# EasyEDA schematic ISL.json

## Sheets
1 Sheet_1: TITLE: Sheet_1; REV: 1.0; Date: 2025-07-10; Sheet: 1/1; Company: Your Company
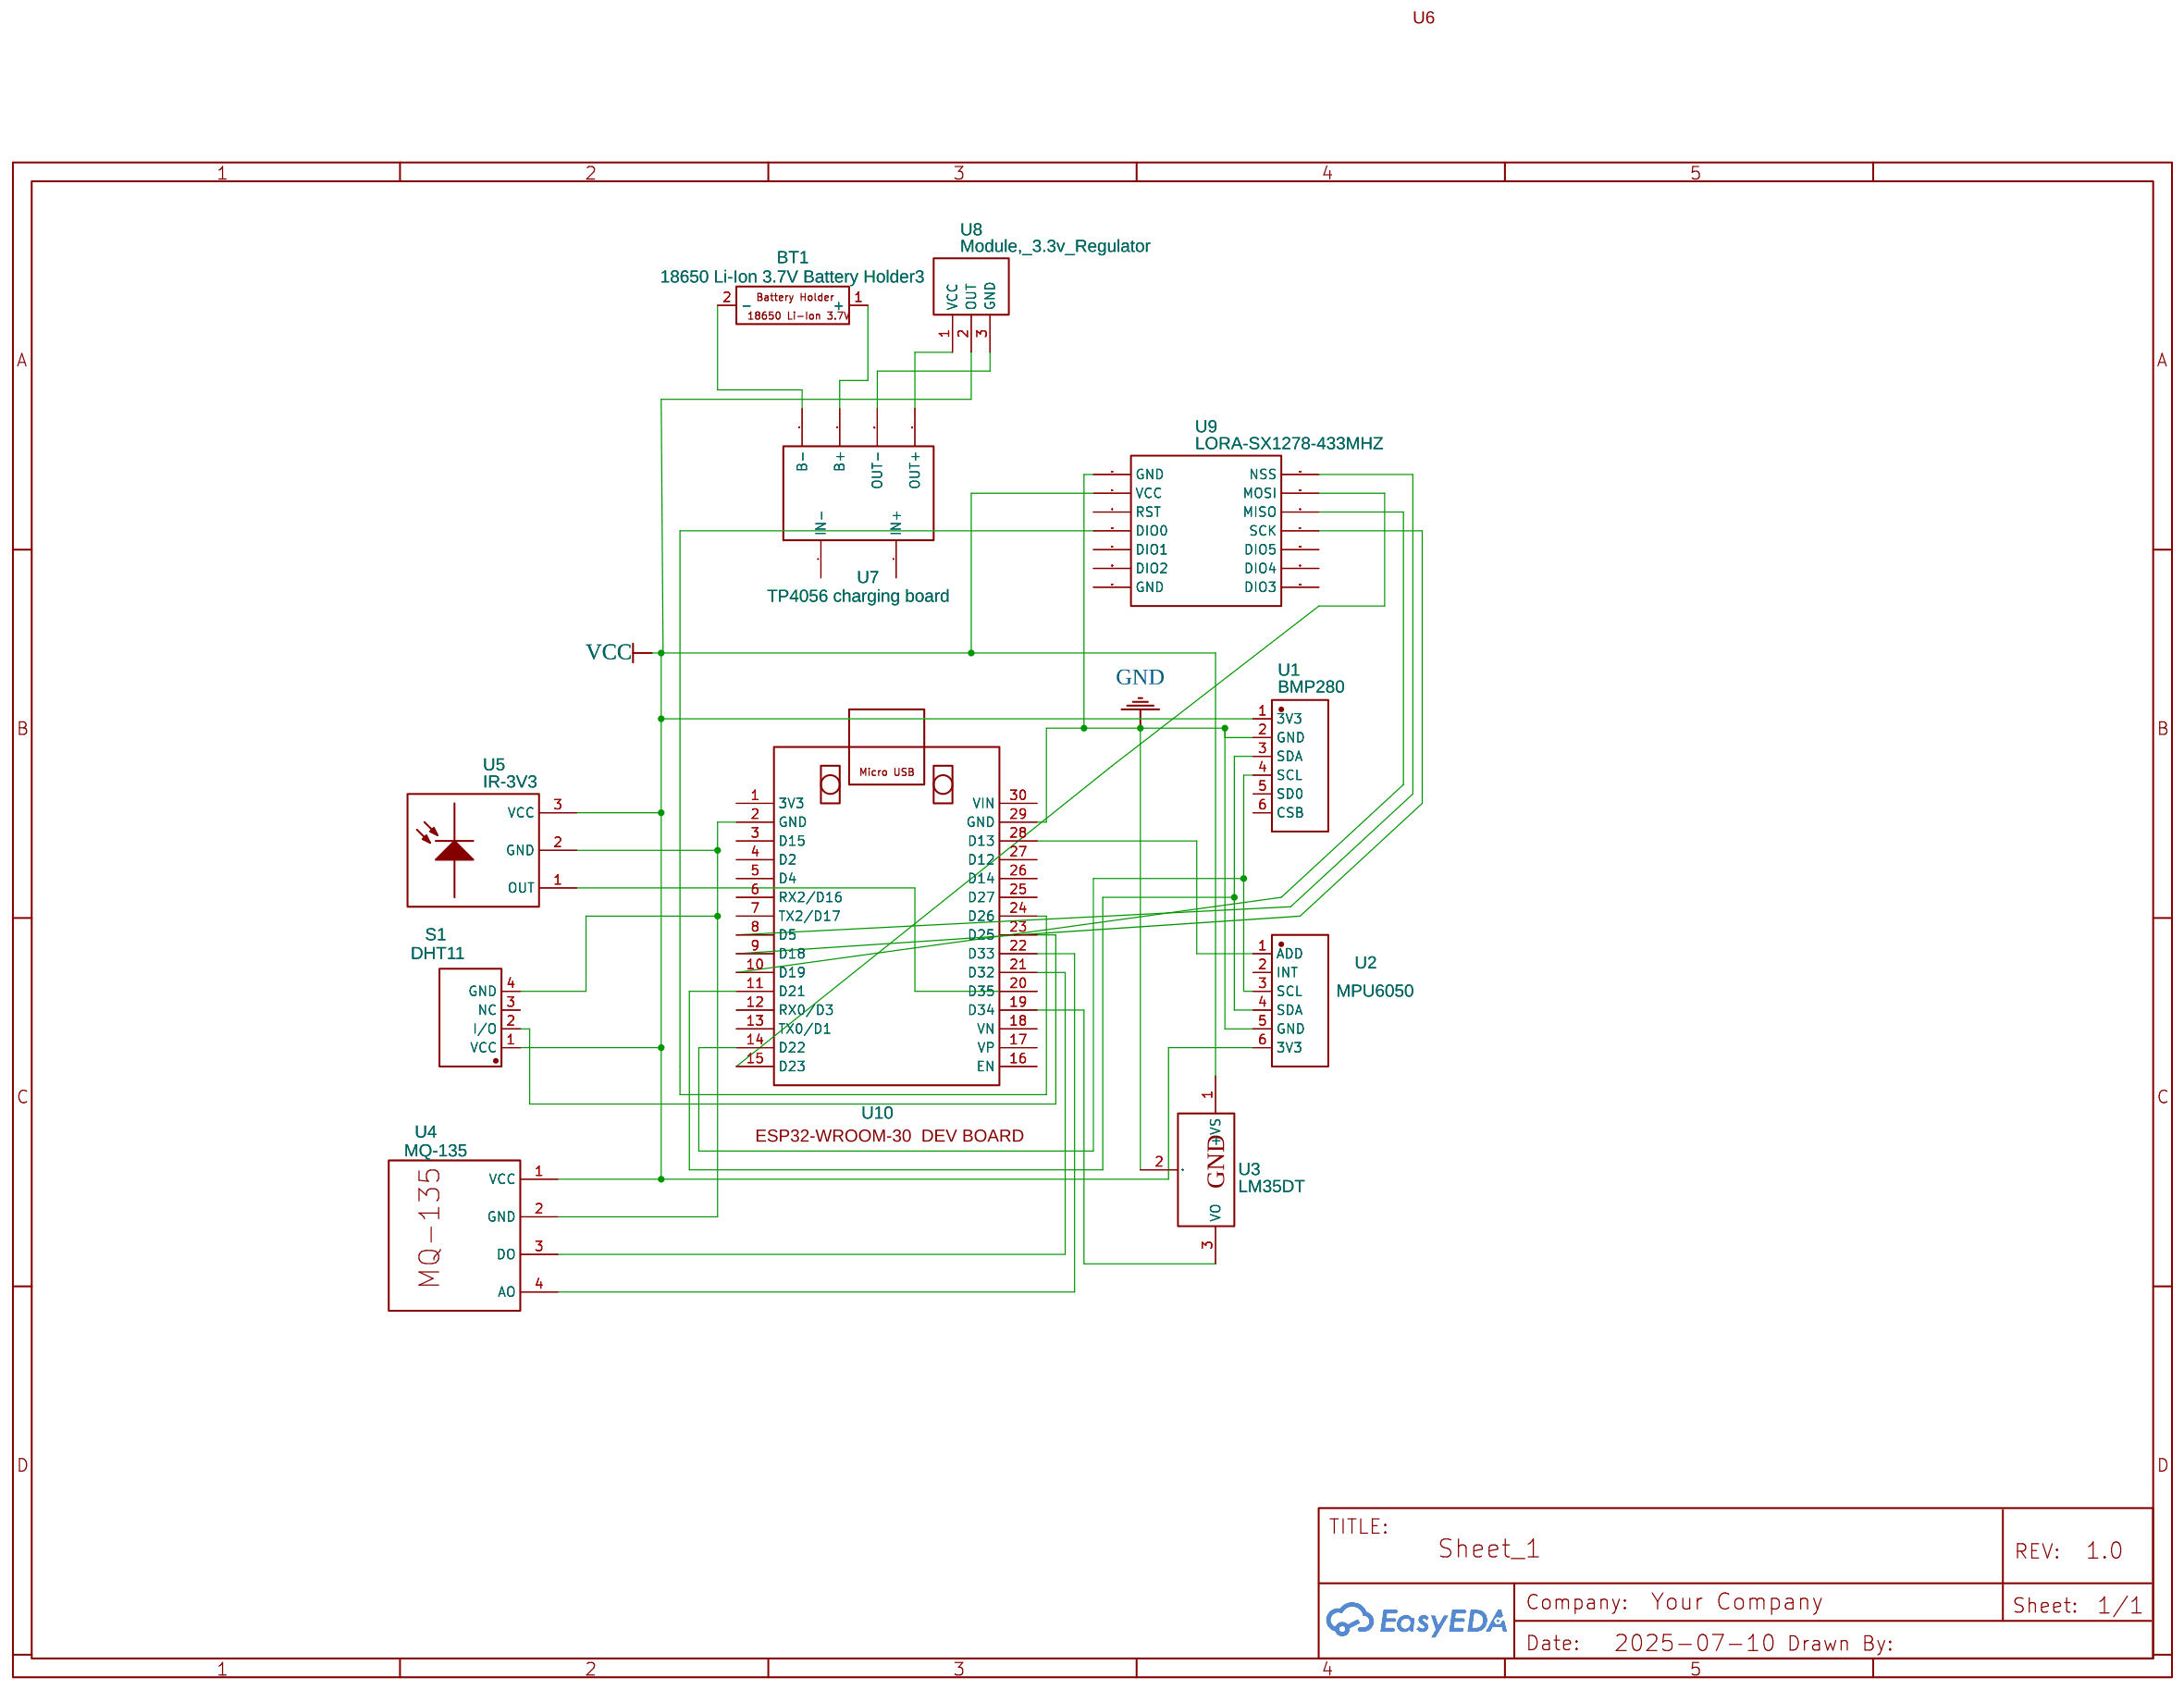
[diagram p0: Sheet_1]
2 Sheet_2: TITLE: Sheet_2; Date: 2025-07-12
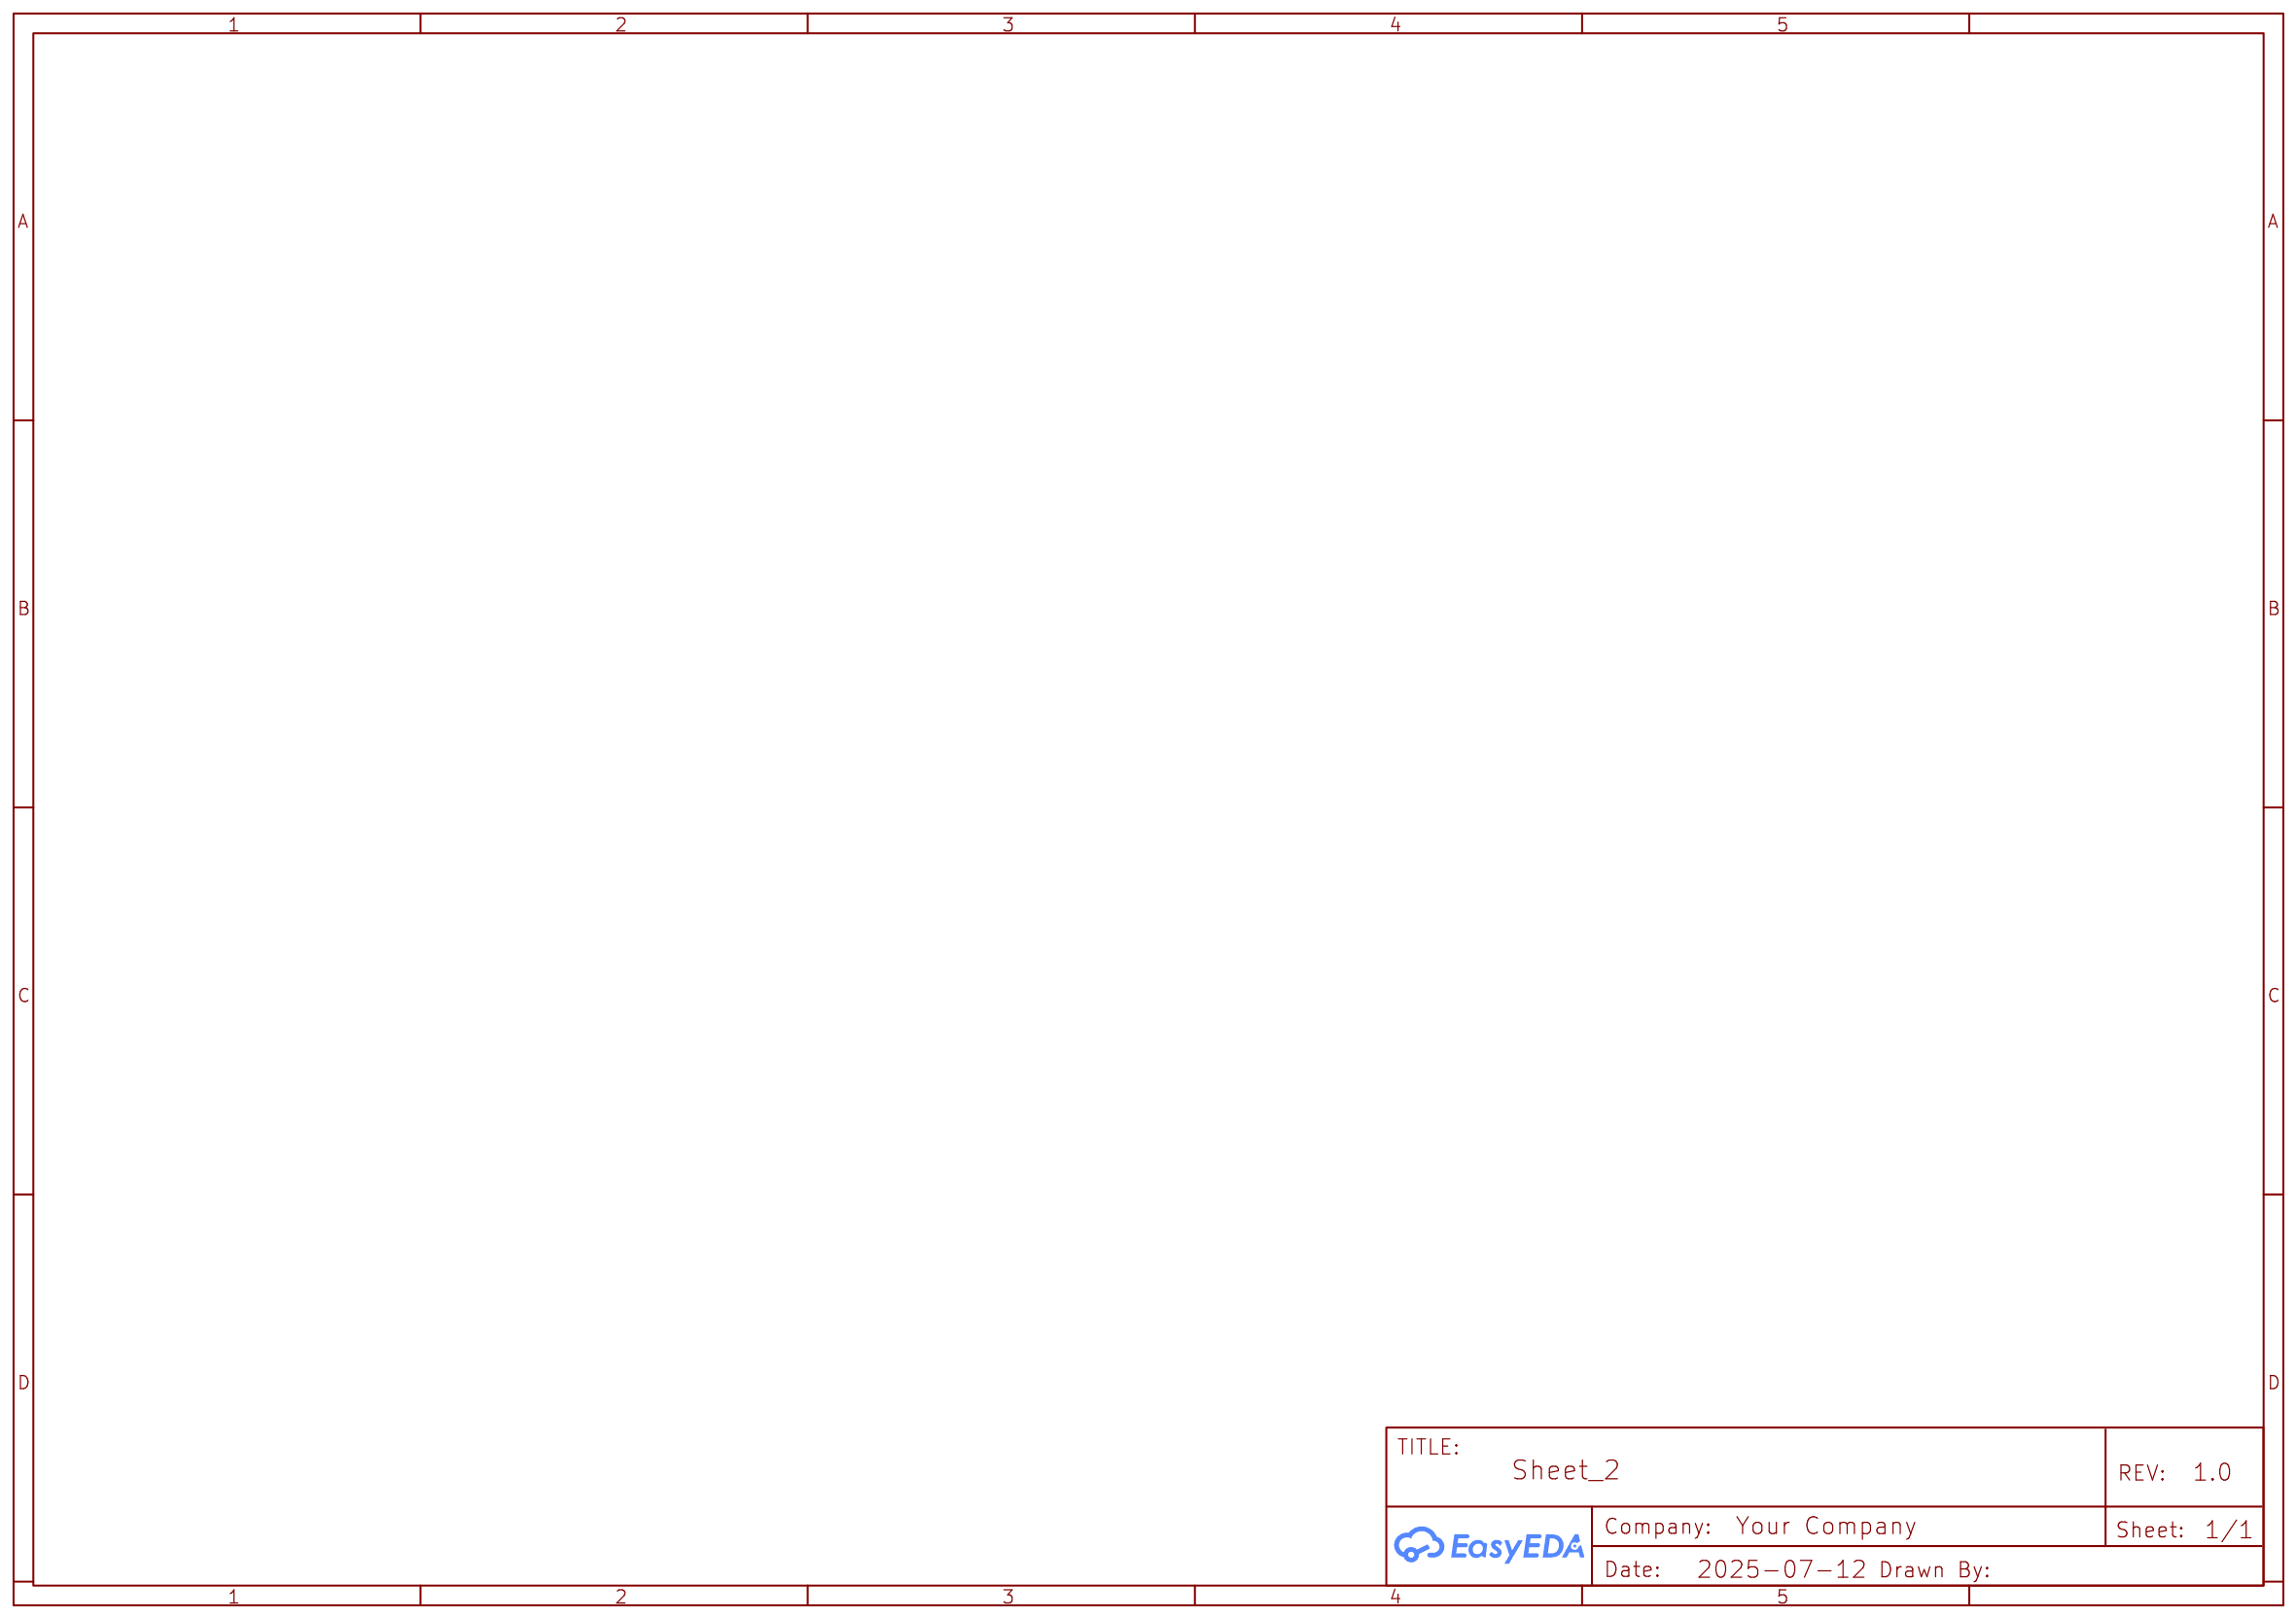
[diagram p1: Sheet_2]

## Parts
BT1  18650 Li-Ion 3.7V Battery Holder3  [18650 LI-ION 3.7V BATTERY HOLDER]
S1  DHT11  [SENSOR-TH_DHT11-1]
U1  BMP280  [COMM-TH_BMP280-TH]
U2  MPU6050  [COMM-TH_MPU6050-TH]
U3  LM35DT  [TO-220-3_L10.0-W4.5-P2.54-L]
U4  MQ-135  [MQ-135]
U5  IR-3V3  [OPTO-TH_3P_L5.3-W4.3]
U7  TP4056 charging board  [TP4056 CHARGING BOARD]
U8  Module,_3.3v_Regulator  [5V_TO_3.3V_STEP-DOWN_VOLTAGE_REGULATOR_AMS1117]
U9  LORA-SX1278-433MHZ  [LORA-SX1278-433MHZ]
U10  ESP32-WROOM-30  DEVB  [ESP32-WROOM-30-DEVBOARD]

## Library data of the parts
BT1 = 18650 Li-Ion 3.7V Battery Holder3: Manufacturer: Smartcube; Manufacturer Part: 18650_Li_BT_3P7V; Supplier Part: 18650_Li_BT_3P7V; Contributor: darrell.devanaputra
S1 = DHT11_C87032: Supplier Part: C87032; Supplier: LCSC; Manufacturer: AOSONG; JLCPCB Part Class: Extended Part
U1 = BMP280_C9900132626: Supplier: LCSC; Supplier Part: C9900132626; Manufacturer: null; Contributor: lcsc
U2 = MPU6050-TH: Supplier: LCSC; Supplier Part: C9900132629; Manufacturer: null; Contributor: lcsc
U3 = LM35DT: Supplier: LCSC; Manufacturer: TI(德州仪器); Manufacturer Part: LM35DT/NOPB; Supplier Part: C32861; JLCPCB Part Class: Extended Part
U4 = MQ-135 SENSOR COPY: Contributor: nikolay.mediana
U5 = IR-3V3: Contributor: lcsc; Supplier: LCSC; Supplier Part: C9900012789; Manufacturer: null; JLCPCB Part Class: Extended Part
U7 = TP4056 charging board: Contributor: gameboycamera
U8 = Module,_3.3v_Regulator: Manufacturer Part: Module, 3.3v Regulator; Contributor: b_amnart
U9 = LORA-SX1278-433MHZ: Manufacturer Part: New SchematicLib; Contributor: jpuelpan528; link: https://www.aliexpress.com/item/SX1276-SX3km-1278-433MHz-Wireless-Transceiver-Module-Long-Distance-Receiver-and-transmitter-LoRa-SPSP-Module/32711941138.html?spm=2114.13010708.0.0.3a994c4d5e4gik
U10 = ESP32-WROOM-30  DEVB: Contributor: elias.beche

## Nets
GND: U1.2(GND) U2.5(GND) U3.2(GND) U9.GND U10.29(GND)
VCC: S1.1(VCC) U1.1(3V3) U2.6(3V3) U3.1(+VS) U4.1(VCC) U5.3(VCC) U8.2(OUT) U9.VCC
Net-(BT1-1): BT1.1(+) U7.B+
Net-(BT1-2): BT1.2(-) U7.B-
Net-(S1-2): S1.2(I/O) U10.23(D25)
Net-(S1-4): S1.4(GND) U4.2(GND) U5.2(GND) U10.2(GND)
Net-(U1-3): U1.3(SDA) U2.4(SDA) U10.11(D21)
Net-(U1-4): U1.4(SCL) U2.3(SCL) U10.14(D22)
Net-(U2-1): U2.1(ADD) U10.28(D13)
Net-(U3-3): U3.3(VO) U10.19(D34)
Net-(U4-3): U4.3(DO) U10.21(D32)
Net-(U4-4): U4.4(AO) U10.22(D33)
Net-(U5-1): U5.1(OUT) U10.20(D35)
Net-(U7-OUT+): U7.OUT+ U8.1(VCC)
Net-(U7-OUT-): U7.OUT- U8.3(GND)
Net-(U9-DIO0): U9.DIO0 U10.24(D26)
Net-(U9-MISO): U9.MISO U10.10(D19)
Net-(U9-MOSI): U9.MOSI U10.15(D23)
Net-(U9-NSS): U9.NSS U10.8(D5)
Net-(U9-SCK): U9.SCK U10.9(D18)

Not connected (* = marked no-connect by the designer): S1 3(NC); U1 5(SD0) 6(CSB); U2 2(INT); U7 IN+ IN-; U9 DIO1 DIO2 DIO3 DIO4 DIO5 RST; U10 1(3V3) 3(D15) 4(D2) 5(D4) 6(RX2/D16) 7(TX2/D17) 12(RX0/D3) 13(TX0/D1) 16(EN) 17(VP) 18(VN) 25(D27) 26(D14) 27(D12) 30(VIN)
